# Altium schematic sheet 接收端V01.SchDoc
size A4
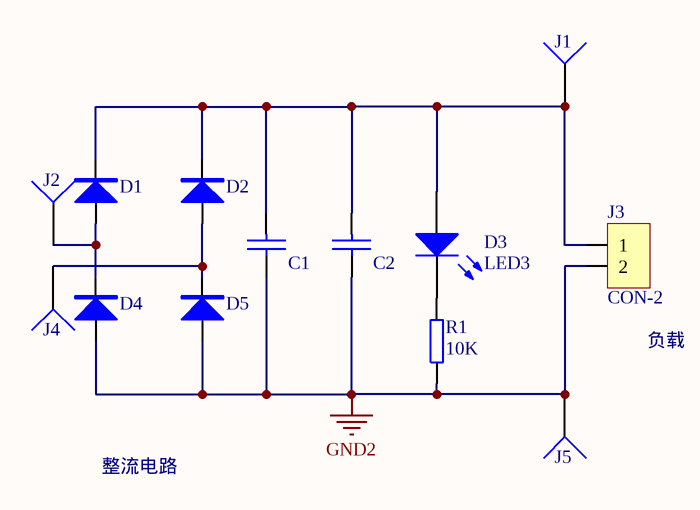
[diagram p0: 接收端V01.SchDoc]

## Parts
C1  0.1uF/160V  [C1020]  (value not drawn)
C2  0.1uF/160V  [C1020]  (value not drawn)
D1  DPG30C400HB  [DO-41]  (value not drawn)
D2  1N4148WS  [DO-41]  (value not drawn)
D3  LED3  [3.5X2.8X1.9]
D4  1N4148WS  [DO-41]  (value not drawn)
D5  1N4148WS  [DO-41]  (value not drawn)
J1  Socket  [JET]  (value not drawn)
J2  Socket  [JET]  (value not drawn)
J3  CON-2  [F396P2-1]
J4  Socket  [JET]  (value not drawn)
J5  Socket  [JET]  (value not drawn)
R1  10K  [1206_R]

## Nets
GND2: C1.2 C2.2 D4.1(A) D5.1(A) J3.2 J5.1 R1.1
NetC1_1: C1.1 C2.1 D1.2(K) D2.2(K) D3.1(A) J1.1 J3.1
NetD1_1: D1.1(A) D4.2(K) J2.1
NetD2_1: D2.1(A) D5.2(K) J4.1
NetD3_2: D3.2(K) R1.2

## Notes on the sheet
- 负载
- 整流电路

## Library data of the parts
C1 C2 = CAP
D1 D2 D4 D5 = 1N4148: 1N4148WS IN4148 0805 SOD323 丝印T4 贴片开关二极管
D3 = LED3: Typical BLUE SiC LED; Published: 8-Jun-2000; LatestRevisionDate: 17-Dec-2003; LatestRevisionNote: PCB Footprint replaced.; DatasheetVersion: 16-Apr-2002; PackageVersion: 16-Apr-2002; PackageReference: 3.5X2.8X1.9; Publisher: Altium Limited; PackageDescription: SM LED; 2 C-Bend Leads; Body 3.5 x 2.8 x 1.9 mm, inc leads (LxWxH typ)
R1 = RES
J1 J2 J4 J5 = Socket: LatestRevisionDate: 17-Jul-2002; LatestRevisionNote: Re-released for DXP Platform.; Publisher: Altium Limited